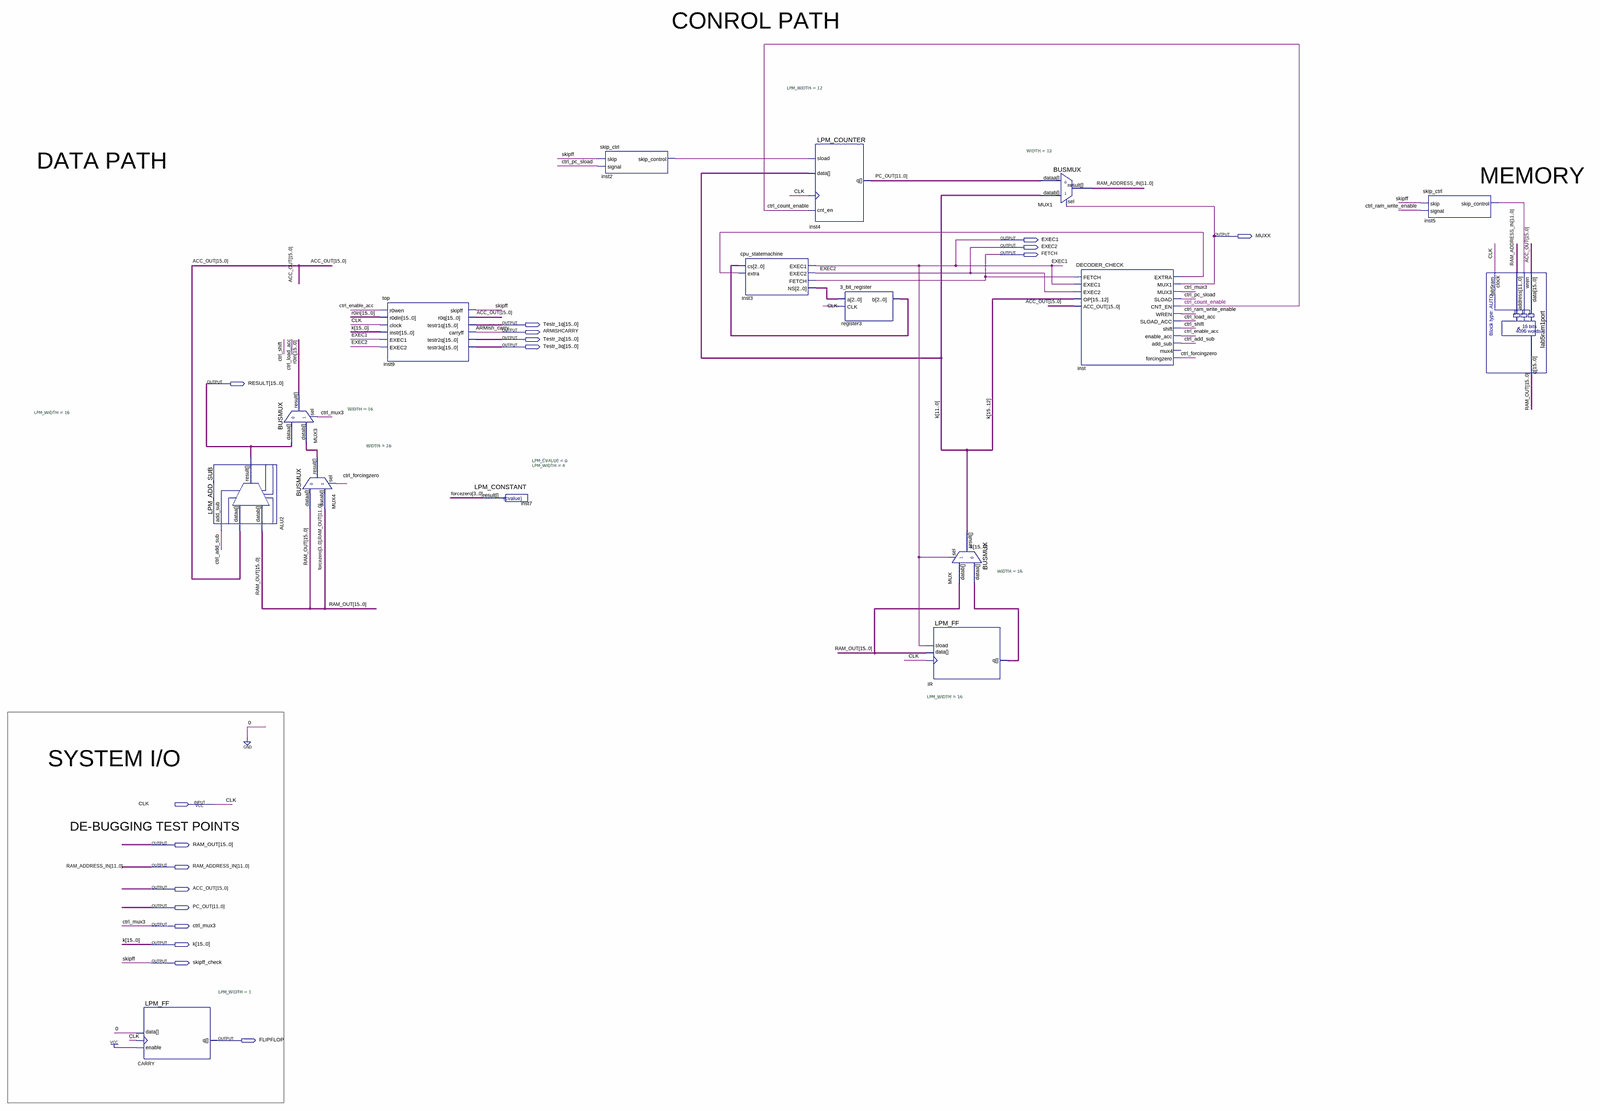
[diagram p0: schematic sheet, whole]
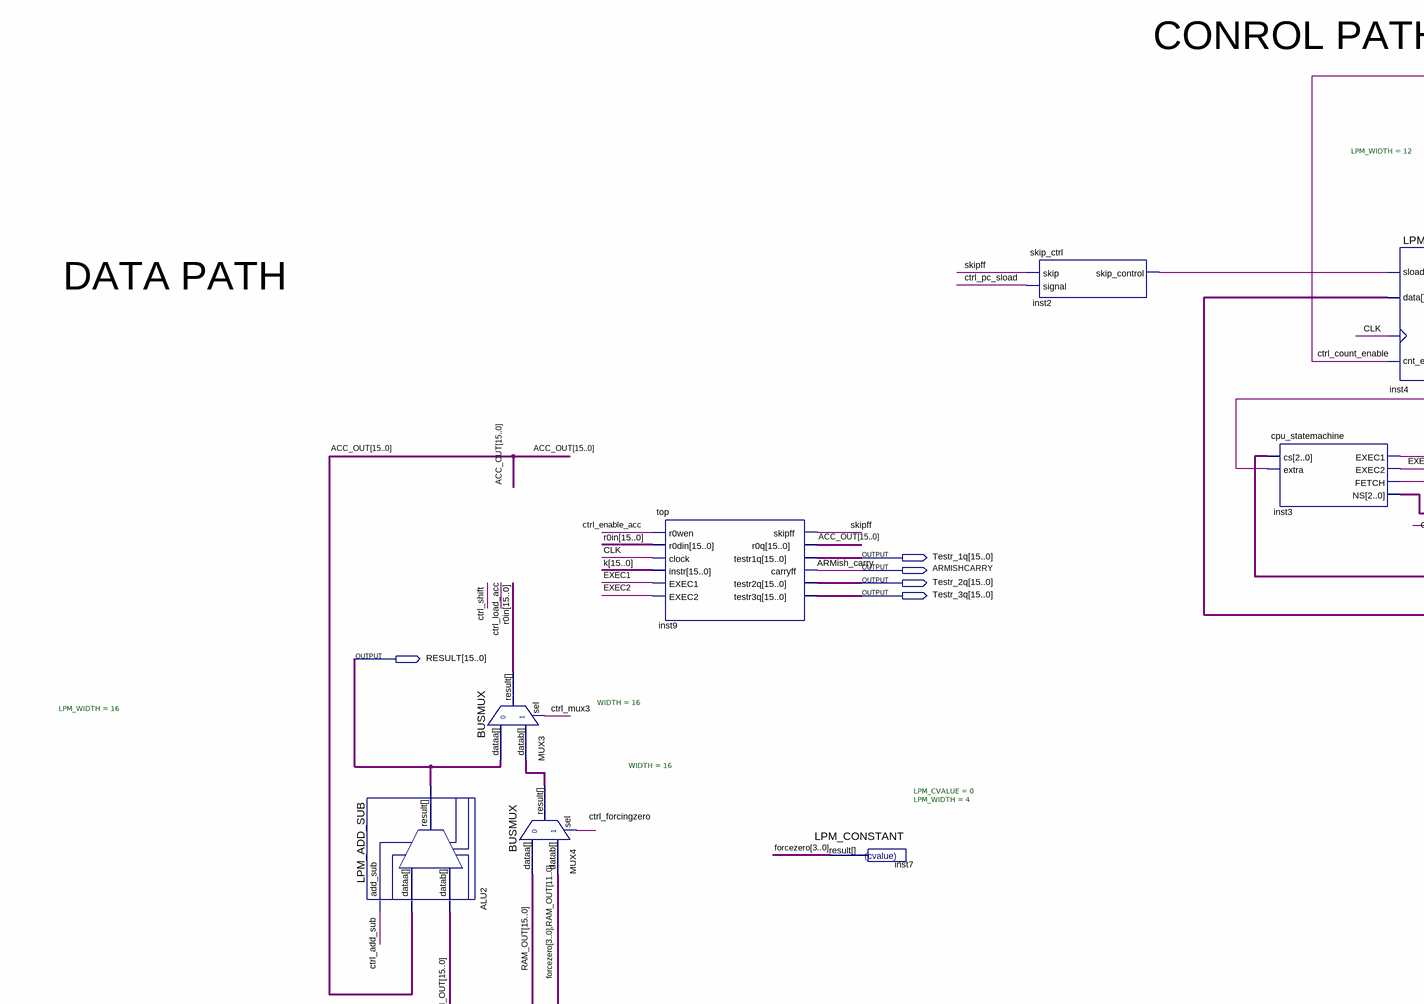
[diagram p1: schematic sheet, upper left part]
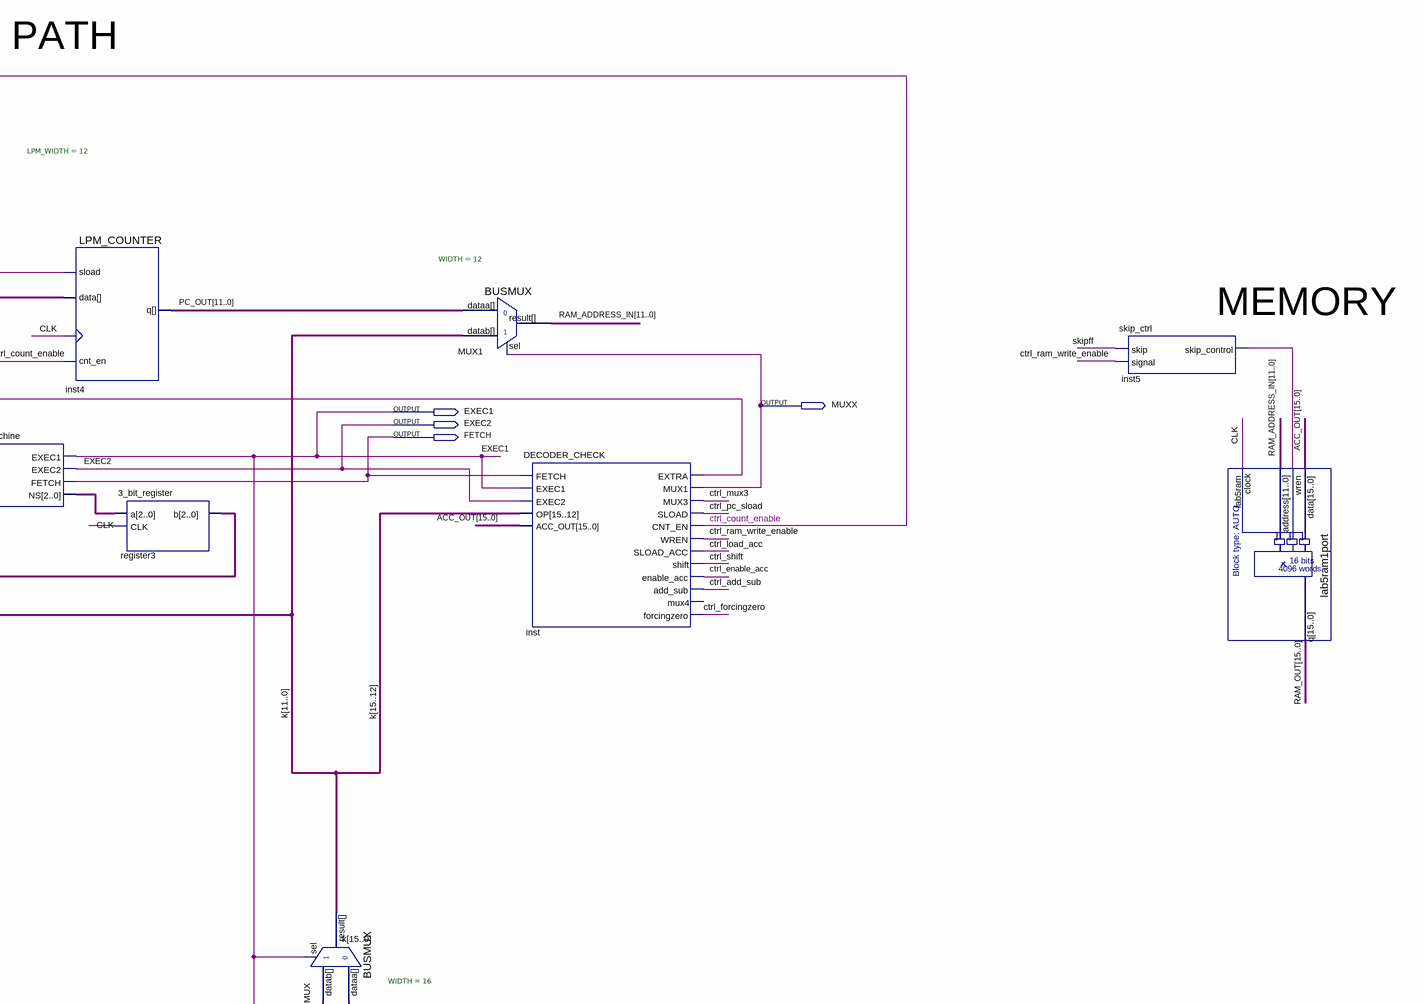
[diagram p2: schematic sheet, upper right part]
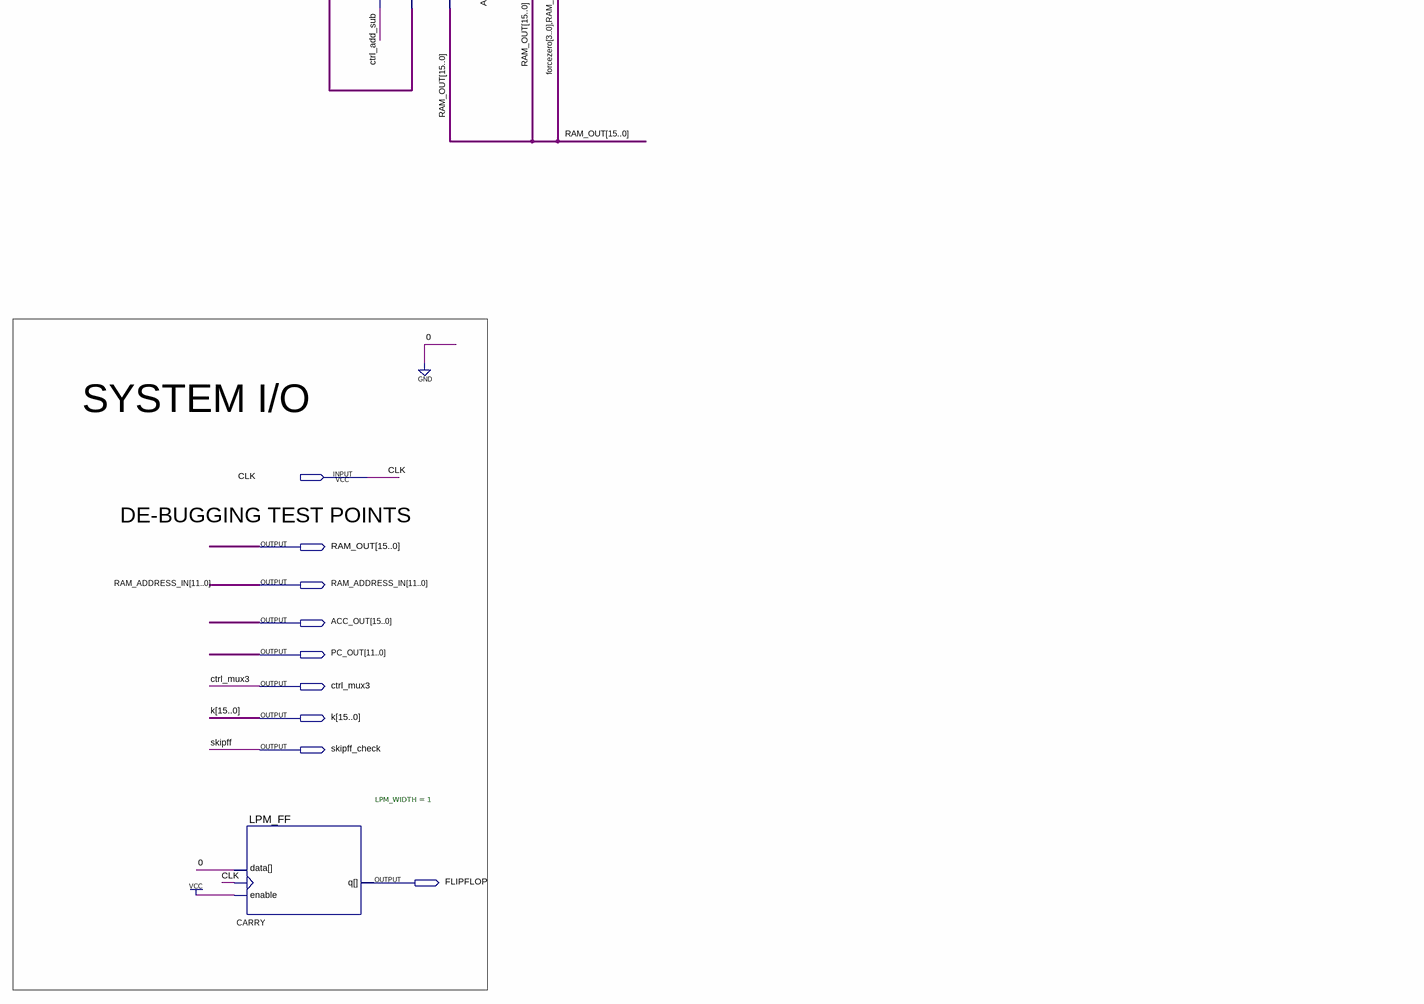
[diagram p3: schematic sheet, lower left part]
// Quartus schematic MU0CPU.bdf as structural Verilog: 16 symbols, 18 pins
module MU0CPU (
  input  CLK,
  output MUXX,
  output EXEC1,
  output EXEC2,
  output FETCH,
  output [15:0] Testr_1q,
  output ARMISHCARRY,
  output [15:0] Testr_2q,
  output [15:0] Testr_3q,
  output [15:0] RESULT,
  output [15:0] RAM_OUT,
  output [11:0] RAM_ADDRESS_IN,
  output [15:0] ACC_OUT,
  output [11:0] PC_OUT,
  output ctrl_mux3,
  output [15:0] k,
  output skipff_check,
  output FLIPFLOP
);

  wire ctrl_add_sub, ctrl_count_enable, ctrl_enable_acc, ctrl_forcingzero, ctrl_load_acc, ctrl_pc_sload,
       ctrl_ram_write_enable, ctrl_shift, inst2_skip_control, inst5_skip_control, inst_extra;
  wire [2:0] inst3_ns, register3_b;
  wire [3:0] forcezero;
  wire [15:0] IR_q, MUX4_result, r0in;

  LPM_FF #(.LPM_WIDTH(1)) CARRY (.clock(CLK), .data(1'b0), .enable(1'b1), .q(FLIPFLOP));
  LPM_ADD_SUB #(.LPM_WIDTH(16)) ALU2 (.add_sub(ctrl_add_sub), .dataa(ACC_OUT), .datab(RAM_OUT), .result(RESULT));
  BUSMUX #(.WIDTH(16)) MUX3 (.datab(MUX4_result), .sel(ctrl_mux3), .dataa(RESULT), .result(r0in));
  BUSMUX #(.WIDTH(16)) MUX4 (
    .datab({forcezero, RAM_OUT[11:0]}), .sel(ctrl_forcingzero), .dataa(RAM_OUT), .result(MUX4_result));
  top inst9 (
    .r0wen(ctrl_enable_acc), .r0din(r0in), .clock(CLK), .instr(k), .EXEC1(EXEC1), .EXEC2(EXEC2),
    .skipff(skipff_check), .r0q(ACC_OUT), .testr1q(Testr_1q), .carryff(ARMISHCARRY), .testr2q(Testr_2q),
    .testr3q(Testr_3q));
  LPM_CONSTANT #(.LPM_CVALUE(0), .LPM_WIDTH(4)) inst7 (.result(forcezero));
  skip_ctrl inst2 (.skip(skipff_check), .signal(ctrl_pc_sload), .skip_control(inst2_skip_control));
  cpu_statemachine inst3 (
    .cs(register3_b), .extra(inst_extra), .EXEC1(EXEC1), .EXEC2(EXEC2), .FETCH(FETCH), .NS(inst3_ns));
  LPM_COUNTER #(.LPM_WIDTH(12)) inst4 (
    .clock(CLK), .cnt_en(ctrl_count_enable), .data(k[11:0]), .sload(inst2_skip_control), .q(PC_OUT));
  \3_bit_register  register3 (.a(inst3_ns), .CLK(CLK), .b(register3_b));
  BUSMUX #(.WIDTH(16)) MUX (.datab(RAM_OUT), .sel(EXEC1), .dataa(IR_q), .result(k));
  LPM_FF #(.LPM_WIDTH(16)) IR (.clock(CLK), .data(RAM_OUT), .sload(EXEC1), .q(IR_q));
  BUSMUX #(.WIDTH(12)) MUX1 (.datab(k[11:0]), .sel(MUXX), .dataa(PC_OUT), .result(RAM_ADDRESS_IN));
  DECODER_CHECK inst (
    .FETCH(FETCH), .EXEC1(EXEC1), .EXEC2(EXEC2), .OP(k[15:12]), .ACC_OUT(ACC_OUT), .EXTRA(inst_extra),
    .MUX1(MUXX), .MUX3(ctrl_mux3), .SLOAD(ctrl_pc_sload), .CNT_EN(ctrl_count_enable),
    .WREN(ctrl_ram_write_enable), .SLOAD_ACC(ctrl_load_acc), .shift(ctrl_shift),
    .enable_acc(ctrl_enable_acc), .add_sub(ctrl_add_sub), .forcingzero(ctrl_forcingzero));  // open: mux4
  skip_ctrl inst5 (.skip(skipff_check), .signal(ctrl_ram_write_enable), .skip_control(inst5_skip_control));
  lab5ram1port lab5ram (.data(ACC_OUT), .wren(inst5_skip_control), .address(RAM_ADDRESS_IN), .clock(CLK), .q(RAM_OUT));

  // Other names for the same wires on the sheet: ARMish_carry = ARMISHCARRY; skipff = skipff_check

  // Notes on the sheet:
  //   CONROL PATH
  //   DATA PATH
  //   MEMORY
  //   SYSTEM I/O
  //   DE-BUGGING TEST POINTS
endmodule
